# EasyEDA Pro project ACDC_整流桥.eprj

# Schematic Schematic1
Board Name: Board1; Create Date: 2025-06-25
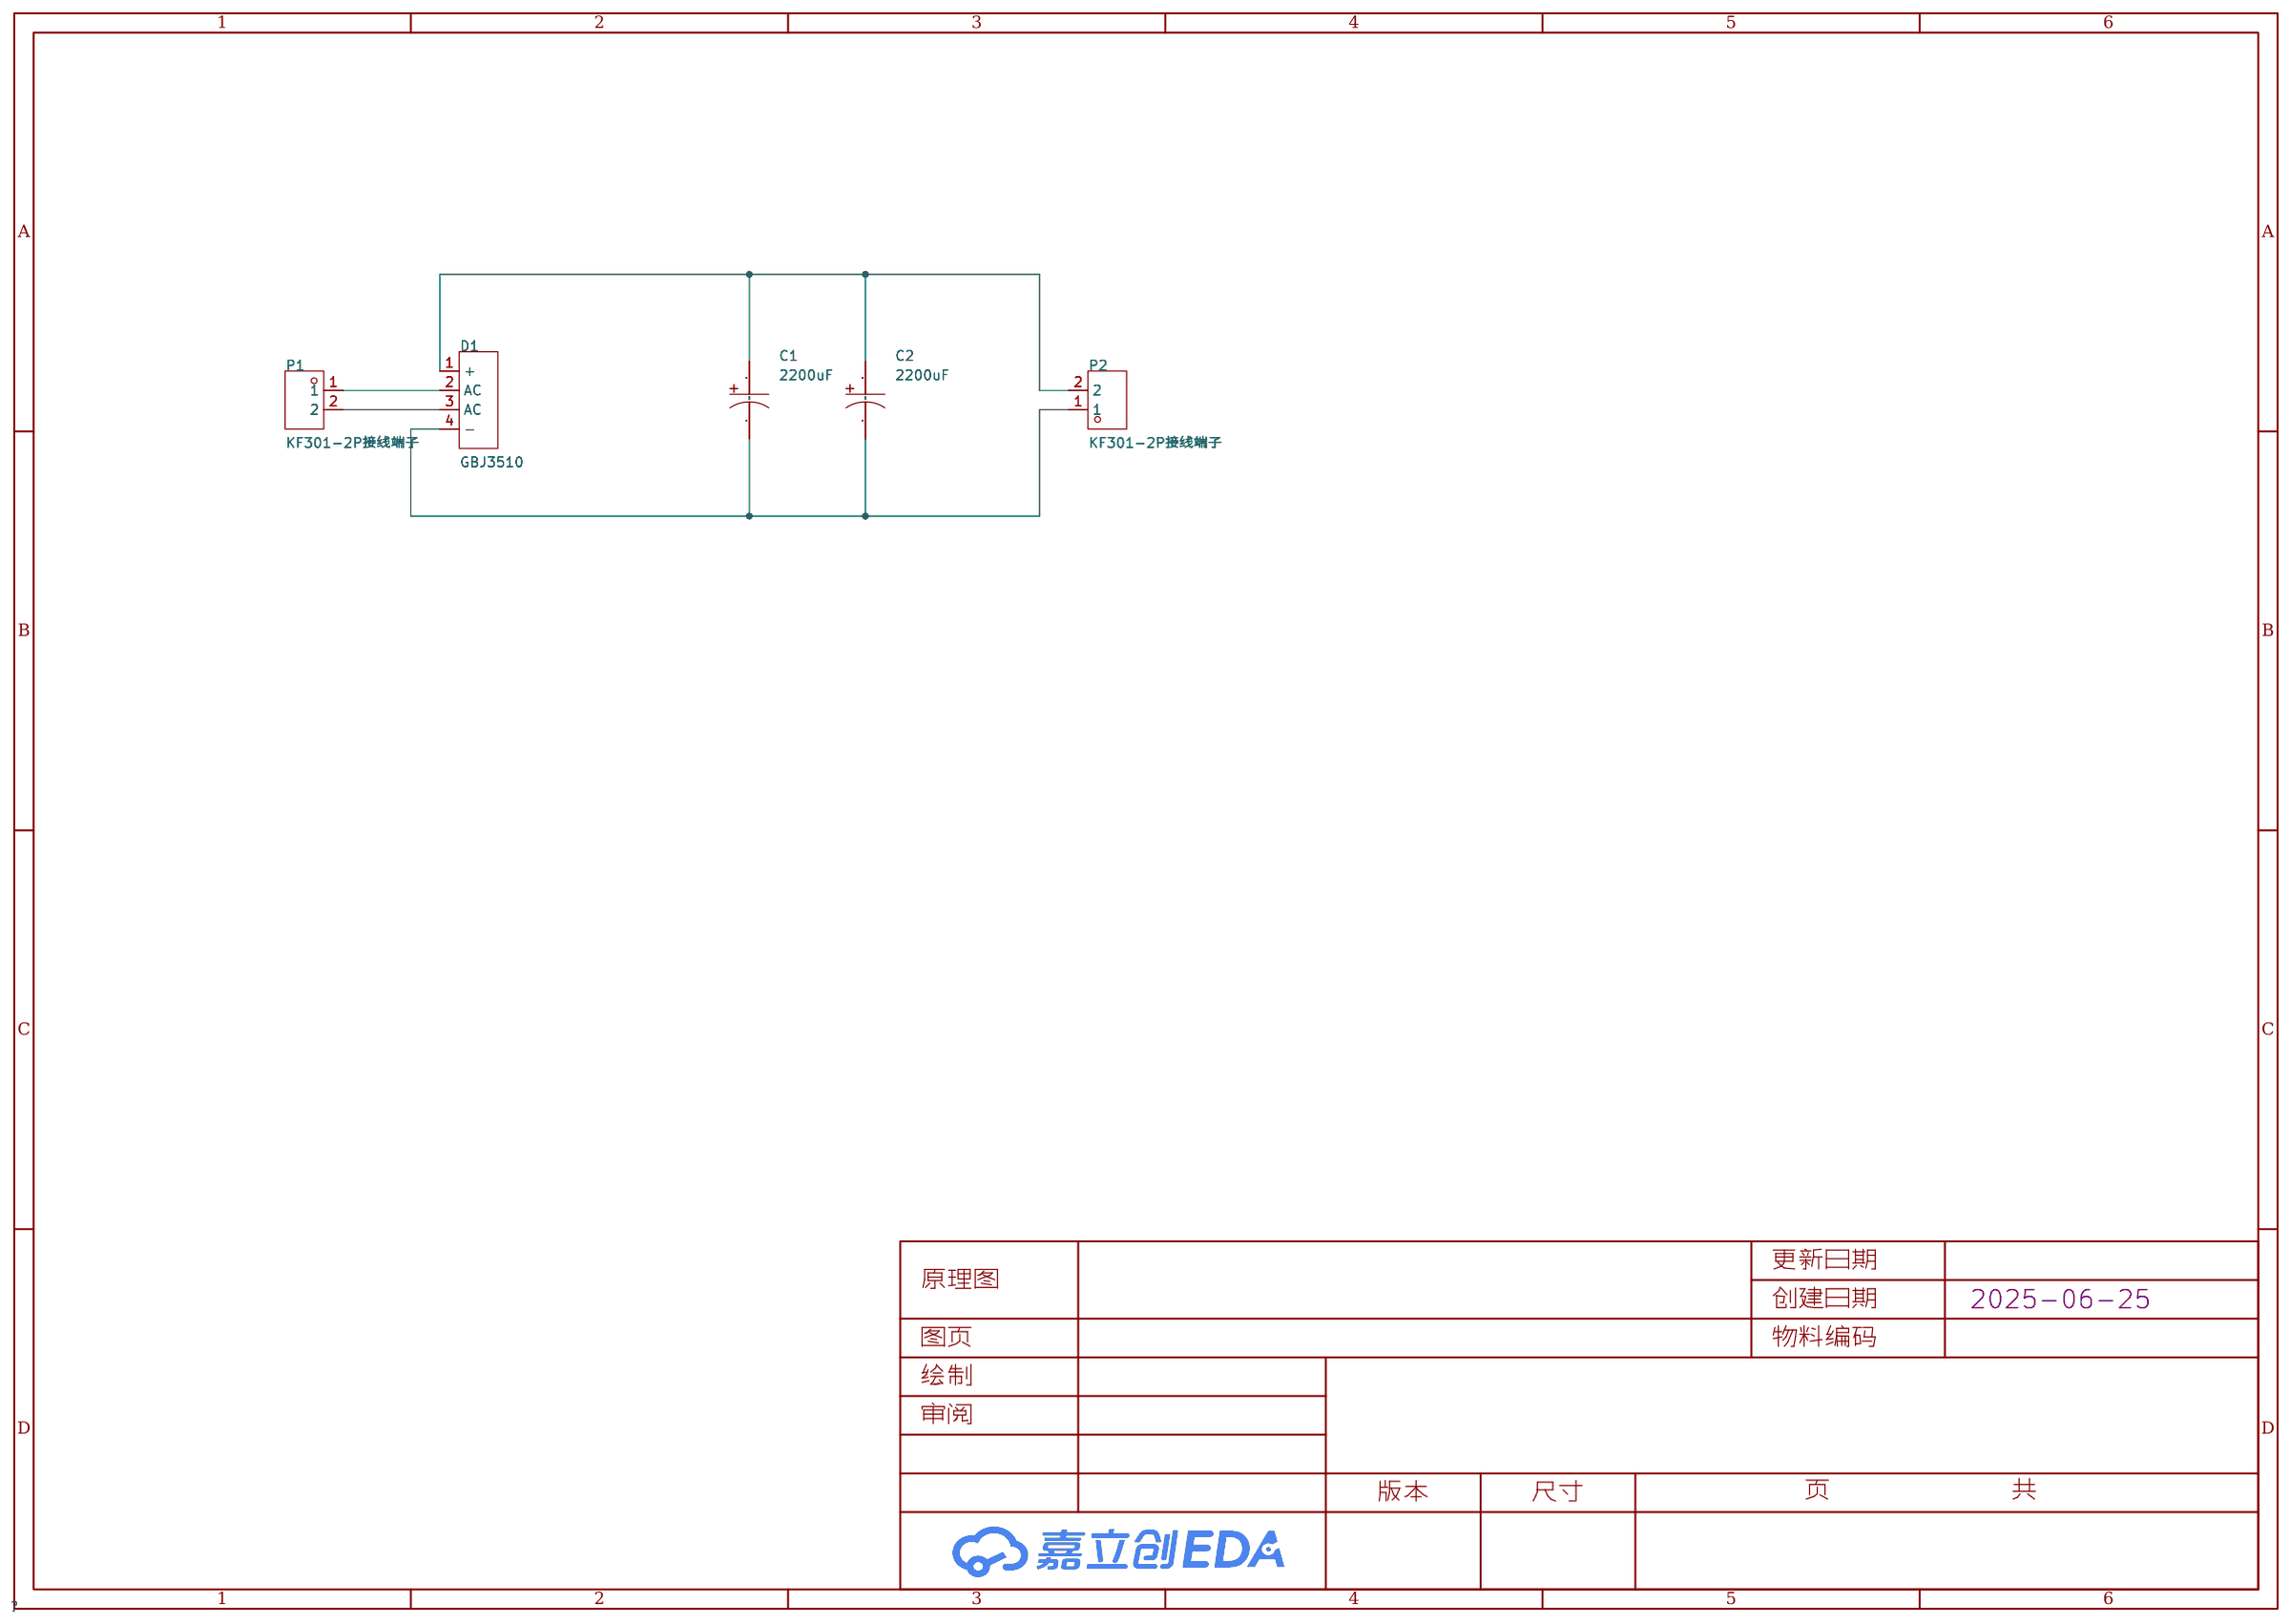
[diagram p0: schematic sheet]

## Parts
C1  2200uF  [CAP-TH_BD22.0-P10.00-D1.4-FD]
C2  2200uF  [CAP-TH_BD22.0-P10.00-D1.4-FD]
D1  GBJ3510  [GBJ_4P-L30.0-W4.6-L]
P1  KF301-2P接线端子  [CONN-TH_XY301V-A-5.0-2P]
P2  KF301-2P接线端子  [CONN-TH_XY301V-A-5.0-2P]

## Library data of the parts
C1 C2 = UVY2A222MRD: LCSC Part Name: 2200uF ±20% 100V; Supplier Part: C433206; Manufacturer: Nichicon(尼吉康); Supplier Footprint: 插件,D22xL50mm; JLCPCB Part Class: 扩展库; Datasheet: https://atta.szlcsc.com/upload/public/pdf/source/20191008/C433206_DFCFFBEF47E42FD3C4A8F864B998CCEC.pdf; Supplier: LCSC; Tolerance: ±20%; Rated Voltage: 100V; Ripple Current: 1.75A@120Hz; Lead Spacing: 10mm; φD: 22mm; L: 50mm; Lifetime @ Temp: 1000hrs@105℃
D1 = GBJ3510: Supplier Part: C917411; Manufacturer: baocheng(宝乘); Supplier Footprint: GBJ-6; JLCPCB Part Class: 扩展库; Datasheet: https://atta.szlcsc.com/upload/public/pdf/source/20201116/C917411_614230F295128D05D132EEE0C9FE27CA.pdf; Supplier: LCSC; Voltage - Forward(Vf@If): 1.1V@10A; Voltage - DC Reverse(Vr): 1kV; Current - Rectified: 35A; Reverse Leakage Current (Ir): 10uA@1kV; Operating Temperature: -55℃~+150℃@(Tj)
P1 P2 = KF301-2P接线端子: Supplier Part: C9900016950; Supplier Footprint: CK301-2P; JLCPCB Part Class: Extended Part; Supplier: LCSC

## Nets
$1N249: D1.2(AC) P1.1
$1N253: D1.3(AC) P1.2
$1N375: C1.1 C2.1 D1.1(+) P2.2
$1N425: C1.2 C2.2 D1.4(-) P2.1

# Schematic Schematic2
Board Name: 三相; Create Date: 2025-06-30; Page Name: P1; Project Name: ACDC_整流桥; Schematic Name: Schematic2; Update Date: 2025-06-30; Company: 嘉立创EDA; Page Size: A4; Version: V1.0
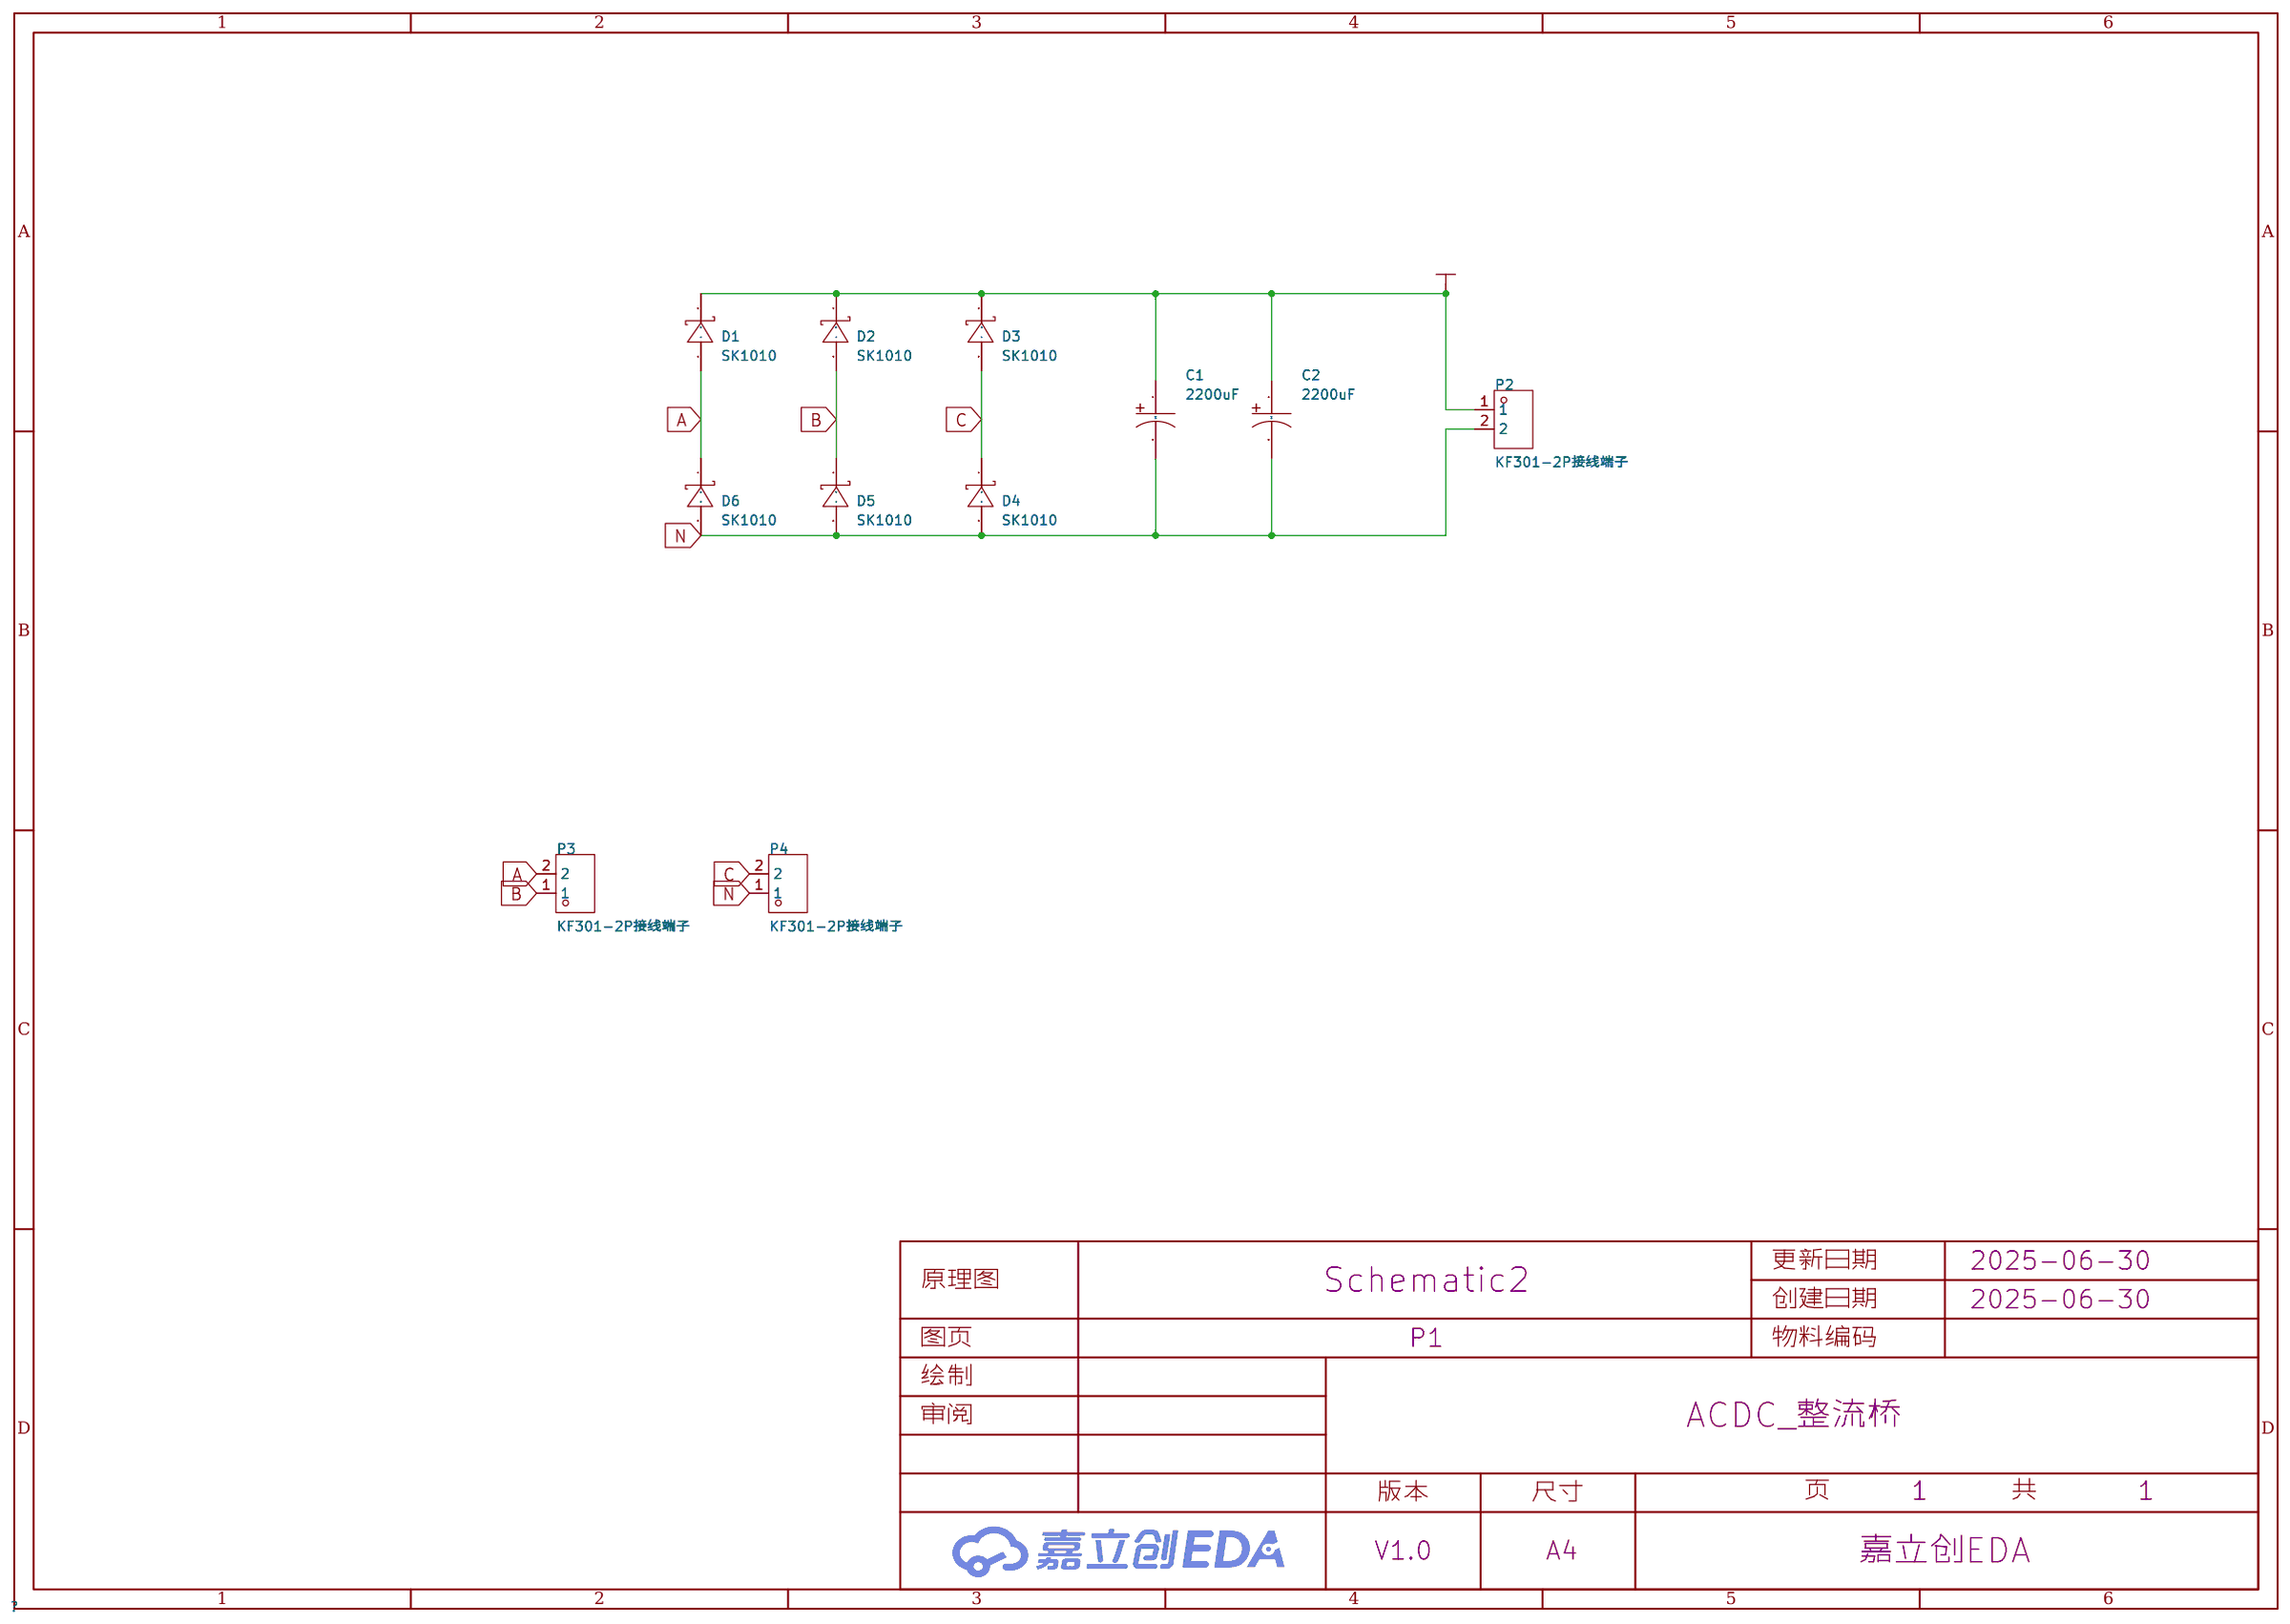
[diagram p1: schematic sheet]

## Parts
C1  2200uF  [CAP-TH_BD22.0-P10.00-D1.4-FD]
C2  2200uF  [CAP-TH_BD22.0-P10.00-D1.4-FD]
D1  SK1010  [SMC_L7.1-W6.2-LS8.1-RD]
D2  SK1010  [SMC_L7.1-W6.2-LS8.1-RD]
D3  SK1010  [SMC_L7.1-W6.2-LS8.1-RD]
D4  SK1010  [SMC_L7.1-W6.2-LS8.1-RD]
D5  SK1010  [SMC_L7.1-W6.2-LS8.1-RD]
D6  SK1010  [SMC_L7.1-W6.2-LS8.1-RD]
P2  KF301-2P接线端子  [CONN-TH_XY301V-A-5.0-2P]
P3  KF301-2P接线端子  [CONN-TH_XY301V-A-5.0-2P]
P4  KF301-2P接线端子  [CONN-TH_XY301V-A-5.0-2P]

## Library data of the parts
C1 C2 = UVY2A222MRD: LCSC Part Name: 2200uF ±20% 100V; Supplier Part: C433206; Manufacturer: Nichicon(尼吉康); Supplier Footprint: 插件,D22xL50mm; JLCPCB Part Class: 扩展库; Datasheet: https://atta.szlcsc.com/upload/public/pdf/source/20191008/C433206_DFCFFBEF47E42FD3C4A8F864B998CCEC.pdf; Supplier: LCSC; Tolerance: ±20%; Rated Voltage: 100V; Ripple Current: 1.75A@120Hz; Lead Spacing: 10mm; φD: 22mm; L: 50mm; Lifetime @ Temp: 1000hrs@105℃
D1-D6 = SK1010: Supplier Part: C3034810; Manufacturer: CJ(江苏长电/长晶); Supplier Footprint: SMCG; JLCPCB Part Class: 扩展库; Datasheet: https://atta.szlcsc.com/upload/public/pdf/source/20220712/6453B9A563D0FBA951B064AEABAD301D.pdf; Supplier: LCSC
P2-P4 = KF301-2P接线端子: Supplier Part: C9900016950; Supplier Footprint: CK301-2P; JLCPCB Part Class: Extended Part; Supplier: LCSC

## Nets
A: D1.2(A) D6.1(C) P3.2
B: D2.2(A) D5.1(C) P3.1
C: D3.2(A) D4.1(C) P4.2
N: C1.2 C2.2 D4.2(A) D5.2(A) D6.2(A) P2.2 P4.1
VDC: C1.1 C2.1 D1.1(C) D2.1(C) D3.1(C) P2.1

# Board PCB1
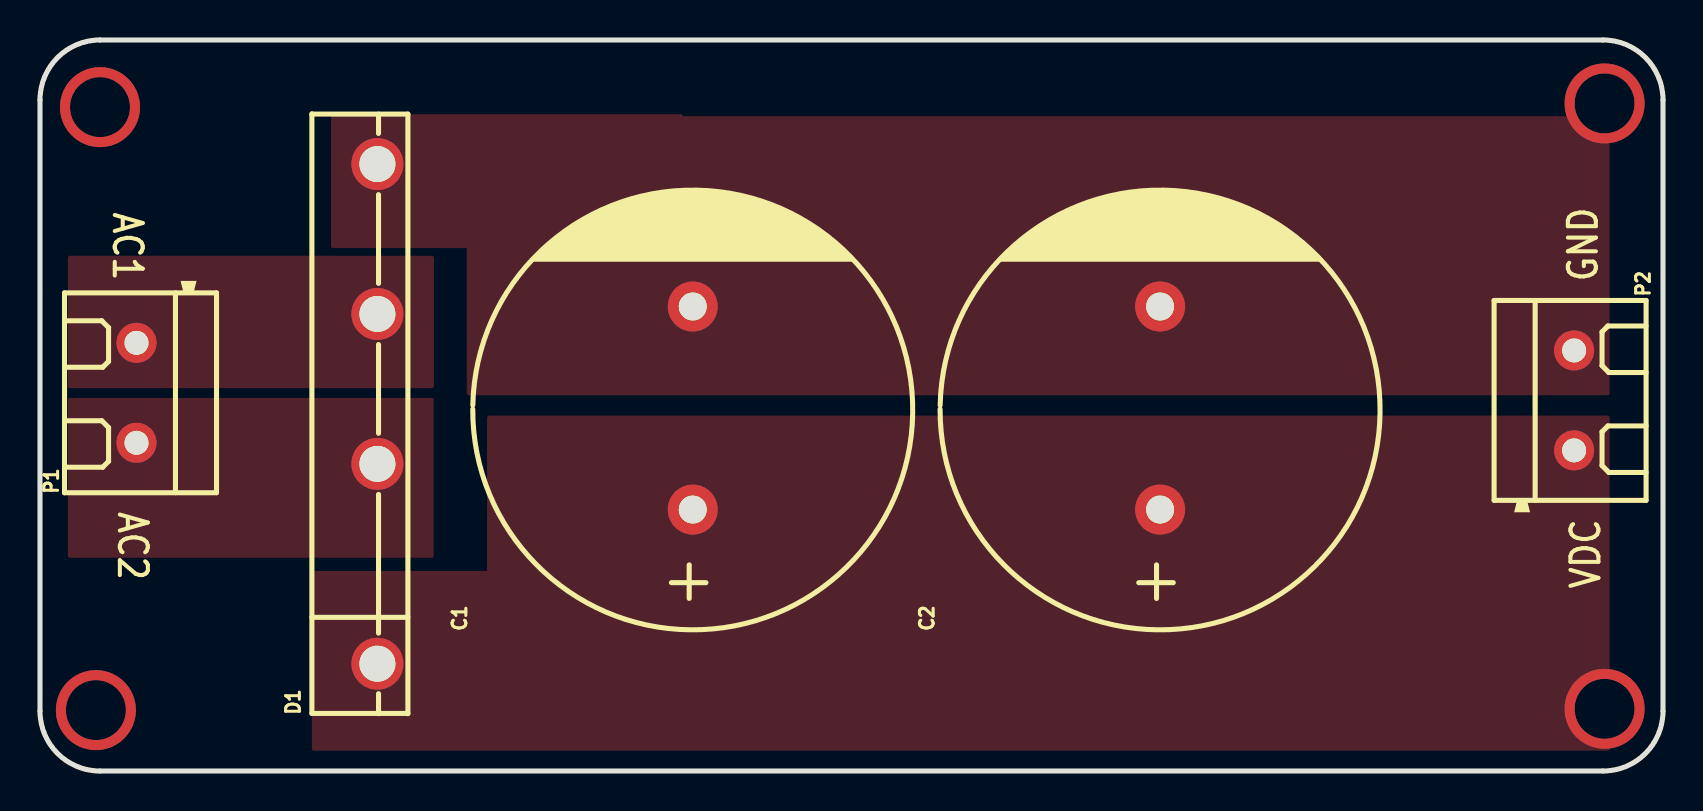
[diagram p2: board, top side]
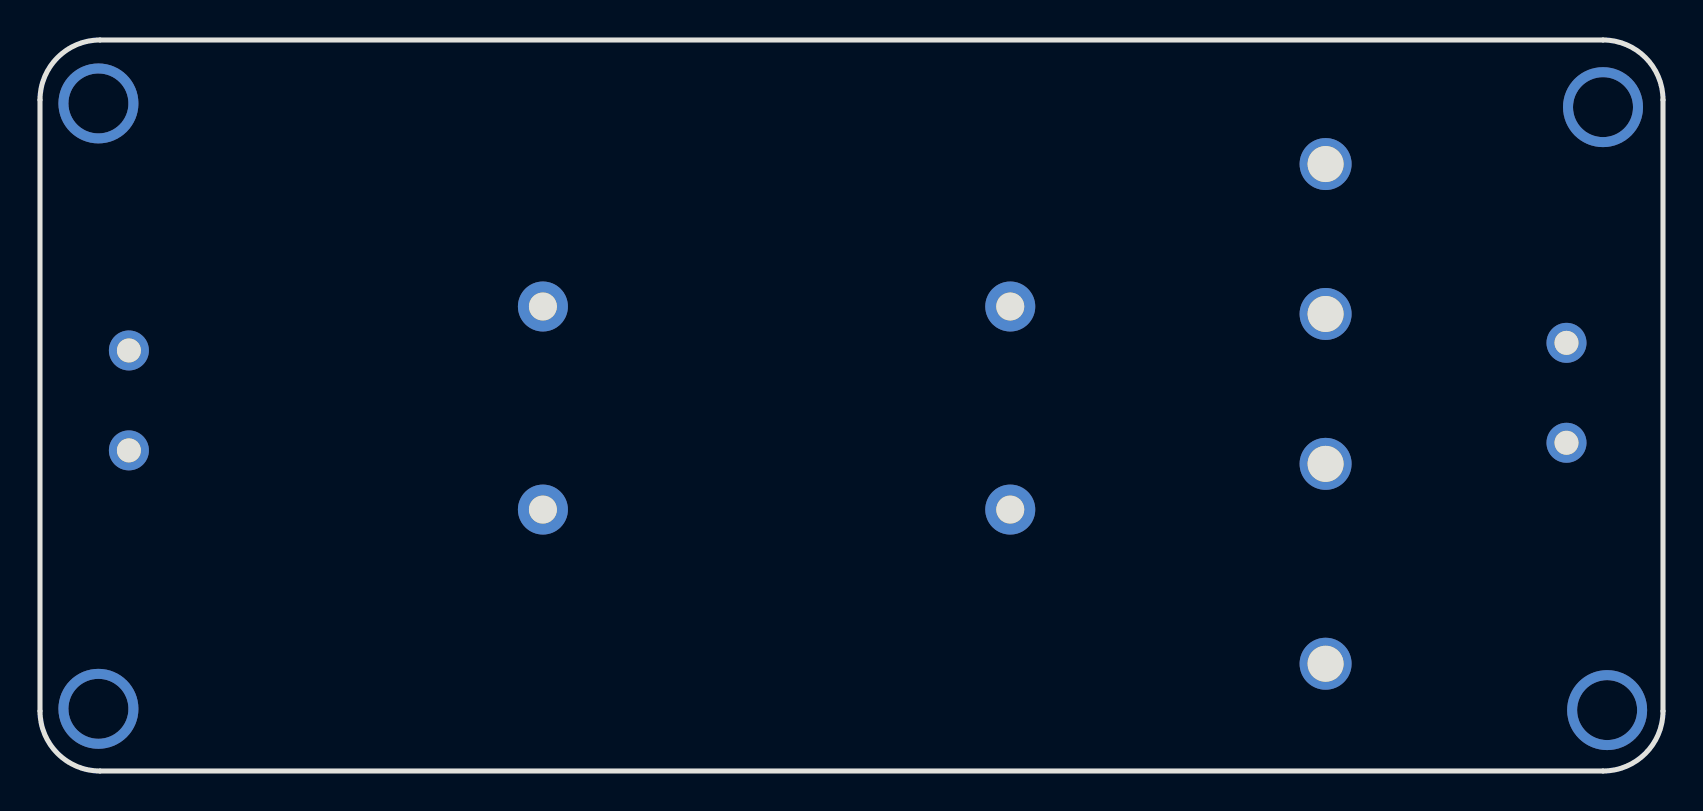
[diagram p3: board, bottom side, seen from below]

Outline 81.15 x 36.58 mm; copper layers: Top Layer, Bottom Layer. Coordinates in mm from the lower left corner of the outline.
Outline path: 0,33.58 0,3 arc(0.88,0.88) 3,0 78.15,0 arc(80.27,0.88) 81.15,3 81.15,33.58 arc(80.27,35.7) 78.15,36.58 3,36.58 arc(0.88,35.7) 0,33.58
Stack: Top Layer 0.035mm / Dielectric1 1.51mm FR4 er 4.5 / Bottom Layer 0.035mm

## Design rules (mm)
template: 自定义配置
spacing copperThickness1oz (default): track to track 0.102, other pairs 0.152 to 0.3
spacing copperThickness2oz: track to track 0.203, other pairs 0.152 to 0.3
track width copperThickness1oz (default): min 0.127, default 0.254, max 2.54
track width copperThickness2oz: min 0.203, default 0.254, max 2.54
differential pair differentialPair (default): width min 0.127, default 0.254, max 2.54; gap min 0.152, default 0.152
via viaSize (default): diameter min 0.5, default 0.61, max 10; hole min 0.3, default 0.305, max 6.3

## Placement (name value [footprint] x y rotation side)
C1  2200uF  [CAP-TH_BD22.0-P10.00-D1.4-FD]  32.64 18.16 90 top
C2  2200uF  [CAP-TH_BD22.0-P10.00-D1.4-FD]  56.01 18.16 90 top
D1  GBJ3510  [GBJ_4P-L30.0-W4.6-L]  16.87 17.87 90 top
P1  KF301-2P接线端子  [CONN-TH_XY301V-A-5.0-2P]  4.83 18.92 90 top
P2  KF301-2P接线端子  [CONN-TH_XY301V-A-5.0-2P]  76.71 18.54 270 top

## Footprints (pads in the part's own frame, mm; a bottom-side part is the same pattern mirrored in y, then rotated)
CAP-TH_BD22.0-P10.00-D1.4-FD
  round 2.5 hole 1.4: 1(-5.08,0) 2(5.08,0)
CONN-TH_XY301V-A-5.0-2P
  round 2 hole 1.2: 1(-2.5,0) 2(2.5,0)
GBJ_4P-L30.0-W4.6-L
  round 2.6 hole 1.8: 1(-12.5,0) 2(-2.5,0) 3(5,0) 4(12.5,0)

## Nets
As in the schematic.

## Via types
v1: diameter 4, hole 3, Top Layer to Bottom Layer, 4 vias

## Routing (per net, layer and track width the routed paths; a pad name or vN(x,y) marks a point on that pad's centre or on a via; arc(x,y) is an arc through that point)
(no net):
  vias: v1(2.79,3.05) v1(3,33.22)
$1N375:
  vias: v1(78.23,3.11)
$1N425:
  vias: v1(78.23,33.4)

## Copper pours and planes (outline as drawn; the poured copper is in the pictures)
$1N249 on Top Layer: 1.4,18.67 19.69,18.67 19.69,10.67 1.4,10.67
$1N253 on Top Layer: 1.4,25.78 19.7,25.78 19.7,19.16 1.4,19.16
$1N375 on Top Layer: 13.6,1.02 13.6,10.01 22.35,10.01 22.35,17.78 78.49,17.78 78.49,1.02
$1N425 on Top Layer: 21.34,18.8 21.34,26.16 14.55,26.16 14.55,32.87 32.13,32.87 32.13,32.77 78.49,32.77 78.49,18.8

## Text on the board
Top Silkscreen Layer: GND | VDC | AC1 | AC2

# Board PCB2
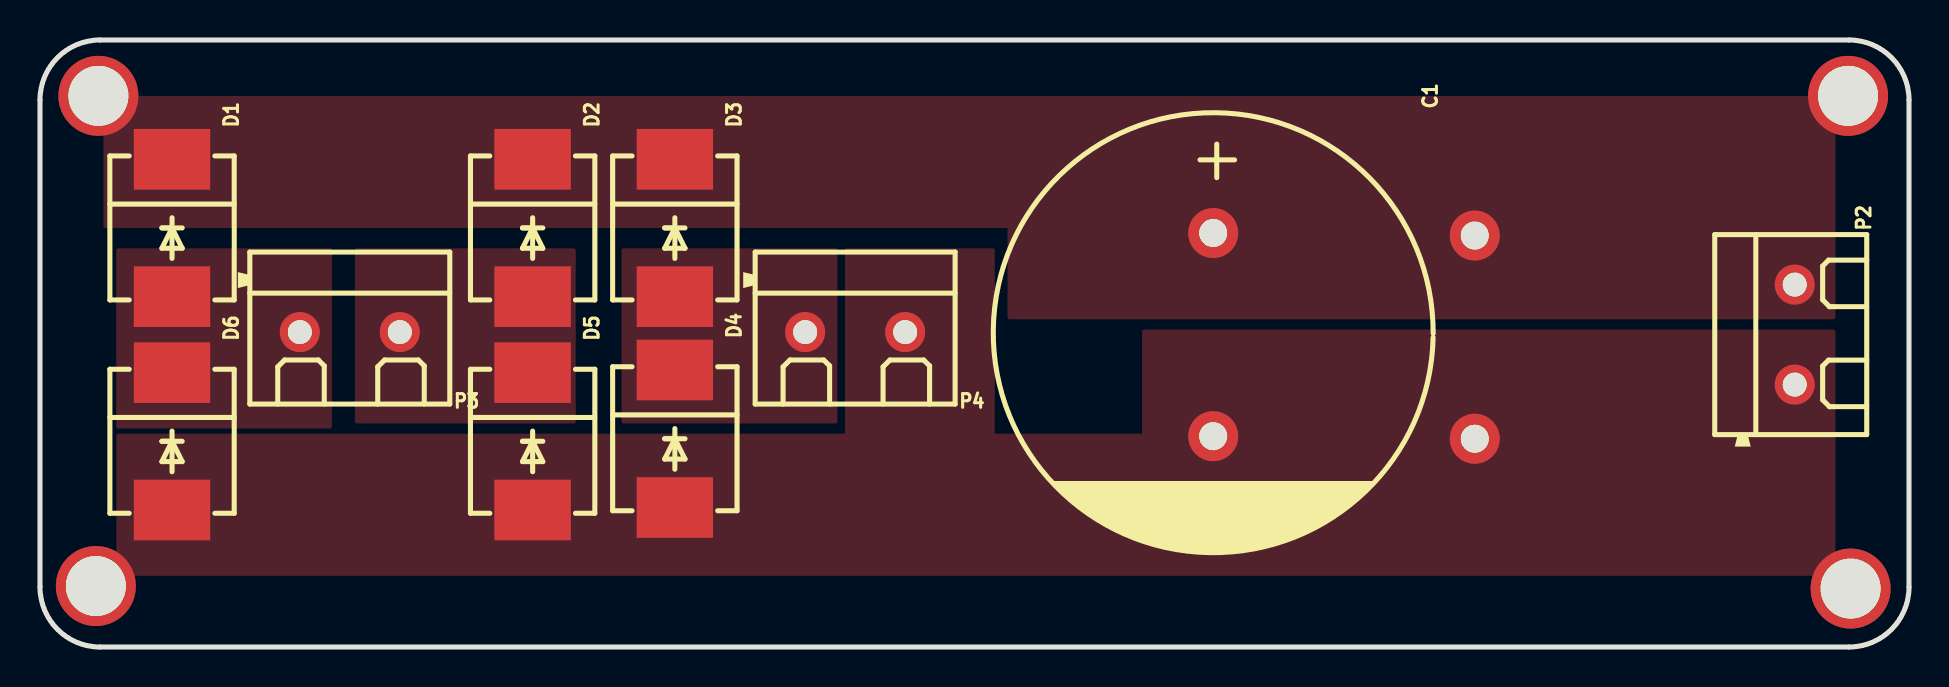
[diagram p4: board, top side]
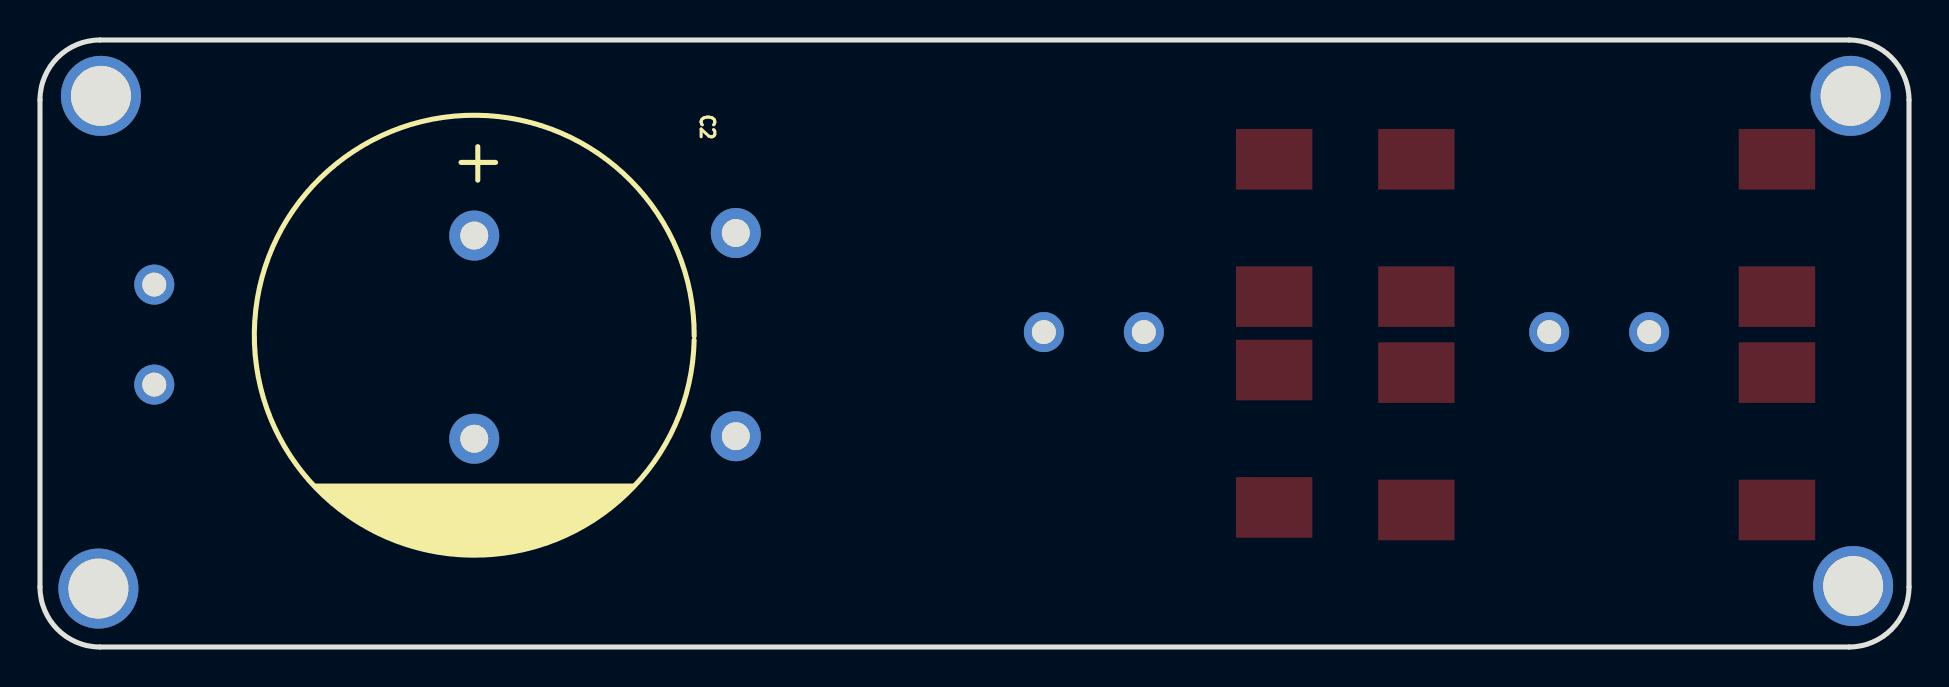
[diagram p5: board, bottom side, seen from below]

Outline 93.47 x 30.35 mm; copper layers: Top Layer, Bottom Layer. Coordinates in mm from the lower left corner of the outline.
Outline path: 0,27.35 0,3 arc(0.88,0.88) 3,0 90.47,0 arc(92.59,0.88) 93.47,3 93.47,27.35 arc(92.59,29.47) 90.47,30.35 3,30.35 arc(0.88,29.47) 0,27.35
Stack: Top Layer 0.035mm / Dielectric1 1.51mm FR4 er 4.5 / Bottom Layer 0.035mm

## Design rules (mm)
template: 自定义配置
spacing copperThickness1oz (default): track to track 0.102, other pairs 0.152 to 0.3
spacing copperThickness2oz: track to track 0.203, other pairs 0.152 to 0.3
track width copperThickness1oz (default): min 0.127, default 0.254, max 2.54
track width copperThickness2oz: min 0.203, default 0.254, max 2.54
differential pair differentialPair (default): width min 0.127, default 0.254, max 2.54; gap min 0.152, default 0.152
via viaSize (default): diameter min 0.5, default 0.61, max 10; hole min 0.3, default 0.305, max 6.3

## Placement (name value [footprint] x y rotation side)
C1  2200uF  [CAP-TH_BD22.0-P10.00-D1.4-FD]  58.67 15.62 270 top
C2  2200uF  [CAP-TH_BD22.0-P10.00-D1.4-FD]  71.76 15.49 270 bottom
D1  SK1010  [SMC_L7.1-W6.2-LS8.1-RD]  6.6 20.95 270 top
D2  SK1010  [SMC_L7.1-W6.2-LS8.1-RD]  24.64 20.95 270 top
D3  SK1010  [SMC_L7.1-W6.2-LS8.1-RD]  31.75 20.95 270 top
D4  SK1010  [SMC_L7.1-W6.2-LS8.1-RD]  31.75 10.41 270 top
D5  SK1010  [SMC_L7.1-W6.2-LS8.1-RD]  24.64 10.29 270 top
D6  SK1010  [SMC_L7.1-W6.2-LS8.1-RD]  6.6 10.29 270 top
NOREF  -  [Pad_e63]  2.79 3.05 0 top
NOREF#2  -  [Pad_e61]  2.92 27.56 0 top
NOREF#3  -  [Pad_e64]  90.55 2.92 0 top
NOREF#4  -  [Pad_e65]  90.42 27.56 0 top
P2  KF301-2P接线端子  [CONN-TH_XY301V-A-5.0-2P]  87.76 15.62 270 top
P3  KF301-2P接线端子  [CONN-TH_XY301V-A-5.0-2P]  15.49 15.75 180 top
P4  KF301-2P接线端子  [CONN-TH_XY301V-A-5.0-2P]  40.77 15.75 180 top

## Footprints (pads in the part's own frame, mm; a bottom-side part is the same pattern mirrored in y, then rotated)
CAP-TH_BD22.0-P10.00-D1.4-FD
  round 2.5 hole 1.4: 1(-5.08,0) 2(5.08,0)
CONN-TH_XY301V-A-5.0-2P
  round 2 hole 1.2: 1(-2.5,0) 2(2.5,0)
Pad_e61
  round 4 hole 3: 1(0,0)
Pad_e63
  round 4 hole 3: 1(0,0)
Pad_e64
  round 4 hole 3: 1(0,0)
Pad_e65
  round 4 hole 3: 1(0,0)
SMC_L7.1-W6.2-LS8.1-RD
  rect 3.03x3.82 smd: 1(-3.435,0) 2(3.435,0)

## Nets
A: D1.2 D6.1 P3.2
B: D2.2 D5.1 P3.1
C: D3.2 D4.1 P4.2
N: C1.2 C2.2 D4.2 D5.2 D6.2 NOREF.1 NOREF#3.1 P2.2 P4.1
VDC: C1.1 C2.1 D1.1 D2.1 D3.1 NOREF#2.1 NOREF#4.1 P2.1

## Copper pours and planes (outline as drawn; the poured copper is in the pictures)
A on Top Layer: 3.81,19.94 14.61,19.94 14.61,10.92 3.81,10.92
B on Top Layer: 15.75,19.94 26.8,19.94 26.8,11.18 15.75,11.18
C on Top Layer: 29.08,19.94 39.88,19.94 39.88,11.18 29.08,11.18
N on Top Layer: 89.79,3.56 3.82,3.56 3.82,10.67 40.26,10.67 40.26,19.94 47.75,19.94 47.75,10.67 55.12,10.67 55.12,15.88 89.79,15.88
VDC on Top Layer: 48.39,16.38 48.39,20.95 3.17,20.95 3.17,27.56 89.79,27.56 89.79,16.38
